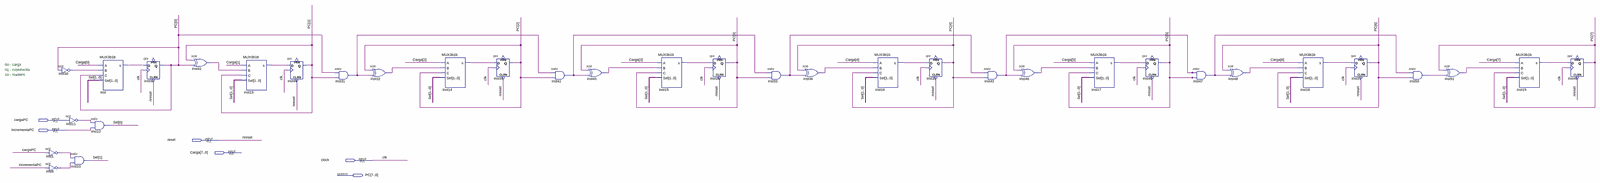
[diagram p0: schematic sheet, whole]
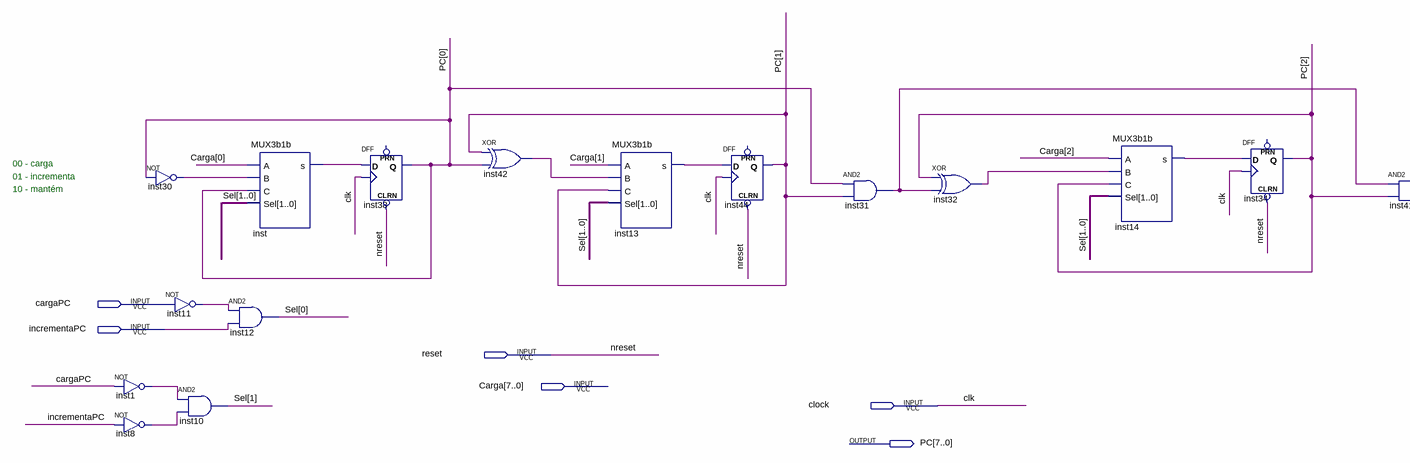
[diagram p1: schematic sheet, left part]
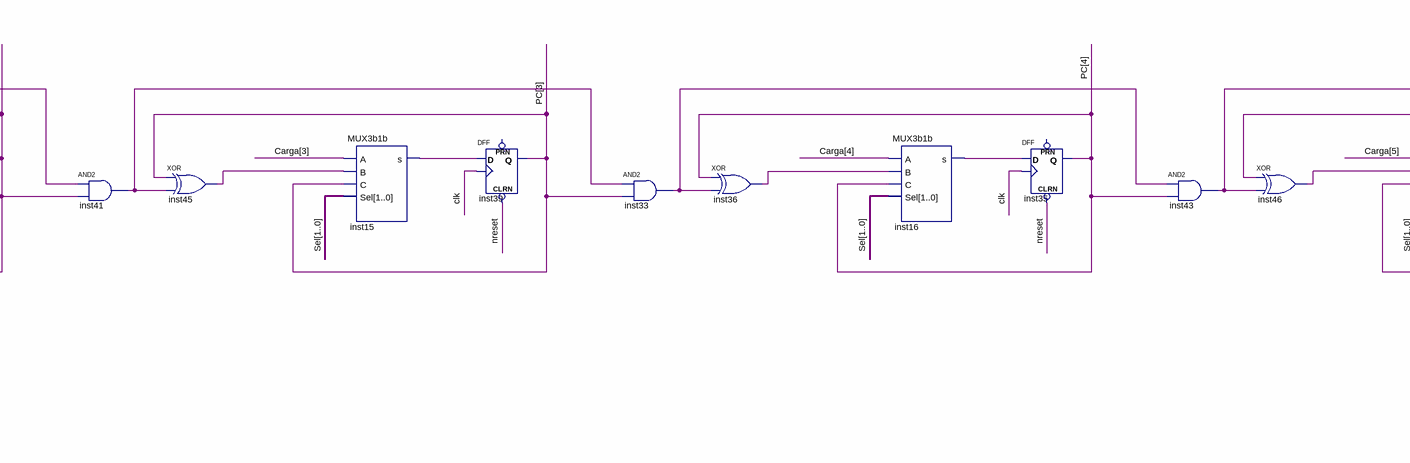
[diagram p2: schematic sheet, centre part]
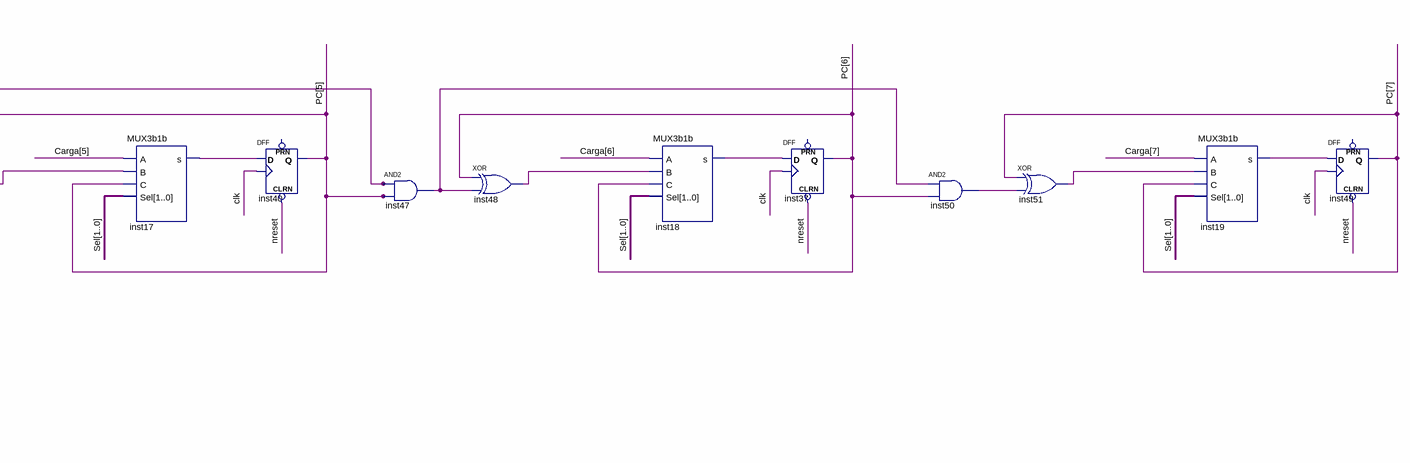
[diagram p3: schematic sheet, right part]
// Quartus schematic PC.bdf as structural Verilog: 35 symbols, 6 pins
module PC (
  input  cargaPC,
  input  incrementaPC,
  input  reset,
  input  [7:0] Carga,
  input  clock,
  output [7:0] PC
);

  wire inst1_out, inst8_out, inst11_out, inst13_s, inst14_s, inst15_s, inst16_s, inst17_s, inst18_s,
       inst19_s, inst30_out, inst31_out, inst32_out, inst33_out, inst36_out, inst41_out, inst42_out,
       inst43_out, inst45_out, inst46_out, inst47_out, inst48_out, inst50_out, inst51_out, inst_s;
  wire [1:0] Sel;

  not inst1 (inst1_out, cargaPC);
  not inst8 (inst8_out, incrementaPC);
  not inst30 (inst30_out, PC[0]);
  not inst11 (inst11_out, cargaPC);
  and inst10 (Sel[1], inst1_out, inst8_out);
  and inst12 (Sel[0], inst11_out, incrementaPC);
  MUX3b1b inst (.A(Carga[0]), .B(inst30_out), .C(PC[0]), .Sel(Sel), .s(inst_s));
  DFF inst38 (.CLRN(reset), .CLK(clock), .D(inst_s), .Q(PC[0]));  // open: PRN
  xor inst42 (inst42_out, PC[1], PC[0]);
  MUX3b1b inst13 (.A(Carga[1]), .B(inst42_out), .C(PC[1]), .Sel(Sel), .s(inst13_s));
  DFF inst44 (.CLRN(reset), .CLK(clock), .D(inst13_s), .Q(PC[1]));  // open: PRN
  and inst31 (inst31_out, PC[0], PC[1]);
  xor inst32 (inst32_out, PC[2], inst31_out);
  MUX3b1b inst14 (.A(Carga[2]), .B(inst32_out), .C(PC[2]), .Sel(Sel), .s(inst14_s));
  DFF inst34 (.CLRN(reset), .CLK(clock), .D(inst14_s), .Q(PC[2]));  // open: PRN
  and inst41 (inst41_out, inst31_out, PC[2]);
  xor inst45 (inst45_out, PC[3], inst41_out);
  MUX3b1b inst15 (.A(Carga[3]), .B(inst45_out), .C(PC[3]), .Sel(Sel), .s(inst15_s));
  DFF inst39 (.CLRN(reset), .CLK(clock), .D(inst15_s), .Q(PC[3]));  // open: PRN
  and inst33 (inst33_out, inst41_out, PC[3]);
  xor inst36 (inst36_out, PC[4], inst33_out);
  MUX3b1b inst16 (.A(Carga[4]), .B(inst36_out), .C(PC[4]), .Sel(Sel), .s(inst16_s));
  DFF inst35 (.CLRN(reset), .CLK(clock), .D(inst16_s), .Q(PC[4]));  // open: PRN
  and inst43 (inst43_out, inst33_out, PC[4]);
  xor inst46 (inst46_out, PC[5], inst43_out);
  MUX3b1b inst17 (.A(Carga[5]), .B(inst46_out), .C(PC[5]), .Sel(Sel), .s(inst17_s));
  DFF inst40 (.CLRN(reset), .CLK(clock), .D(inst17_s), .Q(PC[5]));  // open: PRN
  and inst47 (inst47_out, inst43_out, PC[5]);
  xor inst48 (inst48_out, PC[6], inst47_out);
  MUX3b1b inst18 (.A(Carga[6]), .B(inst48_out), .C(PC[6]), .Sel(Sel), .s(inst18_s));
  DFF inst37 (.CLRN(reset), .CLK(clock), .D(inst18_s), .Q(PC[6]));  // open: PRN
  and inst50 (inst50_out, inst47_out, PC[6]);
  xor inst51 (inst51_out, PC[7], inst50_out);
  MUX3b1b inst19 (.A(Carga[7]), .B(inst51_out), .C(PC[7]), .Sel(Sel), .s(inst19_s));
  DFF inst49 (.CLRN(reset), .CLK(clock), .D(inst19_s), .Q(PC[7]));  // open: PRN

  // Other names for the same wires on the sheet: clk = clock; nreset = reset

  // Notes on the sheet:
  //   00 - carga
  //   01 - incrementa
  //   10 - mantém 
endmodule
